# EAGLE schematic ard_card (EAGLE 5.06)
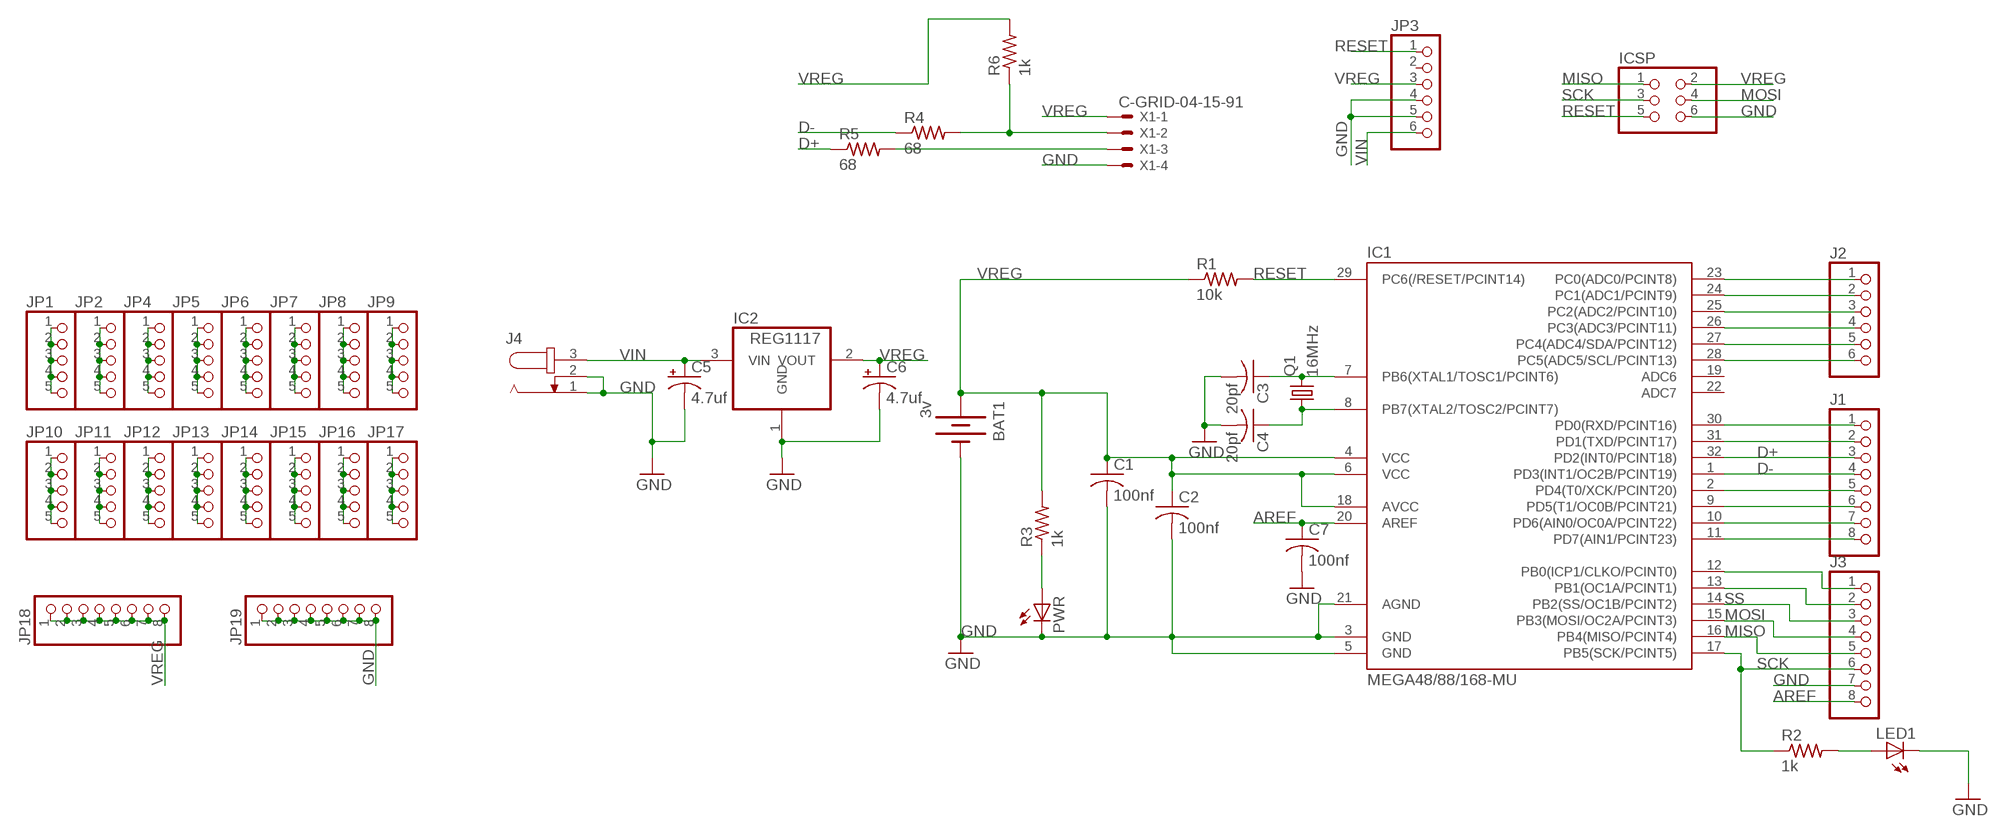
[diagram p0: schematic, sheet 1]

## Parts
BAT1  3v  BATTERY12MM  [BATTCON_12MM]
C1  100nf  C-USC0603  [C0603]
C2  100nf  C-USC0603  [C0603]
C3  20pf  C-USC0603  [C0603]
C4  20pf  C-USC0603  [C0603]
C5  4.7uf  CPOL-USA/3216-18R  [A/3216-18R]
C6  4.7uf  CPOL-USA/3216-18R  [A/3216-18R]
C7  100nf  C-USC0603  [C0603]
IC1  MEGA48/88/168-MU  [MLF32]
IC2  REG1117  [SOT223]
ICSP  PINHD-2X3  [2X03]
J1  PINHD-1X8  [1X08]
J2  PINHD-1X6  [1X06]
J3  PINHD-1X8  [1X08]
J4  JACK-PLUG1  [SPC4078]
JP1  PINHD-1X5  [1X05]
JP2  PINHD-1X5  [1X05]
JP3  PINHD-1X6  [1X06]
JP4  PINHD-1X5  [1X05]
JP5  PINHD-1X5  [1X05]
JP6  PINHD-1X5  [1X05]
JP7  PINHD-1X5  [1X05]
JP8  PINHD-1X5  [1X05]
JP9  PINHD-1X5  [1X05]
JP10  PINHD-1X5  [1X05]
JP11  PINHD-1X5  [1X05]
JP12  PINHD-1X5  [1X05]
JP13  PINHD-1X5  [1X05]
JP14  PINHD-1X5  [1X05]
JP15  PINHD-1X5  [1X05]
JP16  PINHD-1X5  [1X05]
JP17  PINHD-1X5  [1X05]
JP18  PINHD-1X8  [1X08]
JP19  PINHD-1X8  [1X08]
LED1  LEDCHIP-LED0603  [CHIP-LED0603]
PWR  LEDCHIP-LED0603  [CHIP-LED0603]
Q1  16MHz  CRYSTAL5X3  [CRYSTAL-SMD-5X3]
R1  10k  R-US_R0603  [R0603]
R2  1k  R-US_R0603  [R0603]
R3  1k  R-US_R0603  [R0603]
R4  68  R-US_R0603  [R0603]
R5  68  R-US_R0603  [R0603]
R6  1k  R-US_R0603  [R0603]
X1  C-GRID-04-15-91  [15-91-04]

## Nets
AREF: C7.1 IC1.20(AREF) J3.8
D+: IC1.32(PD2(INT0/PCINT18)) J1.3 R5.1
D-: IC1.1(PD3(INT1/OC2B/PCINT19)) J1.4 R4.1
GND: BAT1.GND(-) C1.2 C2.2 C3.2 C4.2 C5.- C6.- C7.2 IC1.3(GND) IC1.5(GND) IC1.21(AGND) IC2.1(GND) ICSP.6 J3.7 J4.1 J4.2 JP3.4 JP3.5 JP19.1 JP19.2 JP19.3 JP19.4 JP19.5 JP19.6 JP19.7 JP19.8 LED1.C PWR.C X1.4
MISO: IC1.16(PB4(MISO/PCINT4)) ICSP.1 J3.5
MOSI: IC1.15(PB3(MOSI/OC2A/PCINT3)) ICSP.4 J3.4
N$1: C3.1 IC1.7(PB6(XTAL1/TOSC1/PCINT6)) Q1.3
N$2: C4.1 IC1.8(PB7(XTAL2/TOSC2/PCINT7)) Q1.1
N$3: PWR.A R3.1
N$4: R5.2 X1.3
N$6: LED1.A R2.2
N$7: IC1.23(PC0(ADC0/PCINT8)) J2.1
N$8: IC1.24(PC1(ADC1/PCINT9)) J2.2
N$9: IC1.25(PC2(ADC2/PCINT10)) J2.3
N$10: IC1.26(PC3(ADC3/PCINT11)) J2.4
N$11: IC1.27(PC4(ADC4/SDA/PCINT12)) J2.5
N$12: IC1.28(PC5(ADC5/SCL/PCINT13)) J2.6
N$13: IC1.30(PD0(RXD/PCINT16)) J1.1
N$14: IC1.31(PD1(TXD/PCINT17)) J1.2
N$15: R4.2 R6.1 X1.2
N$16: JP1.1 JP1.2 JP1.3 JP1.4 JP1.5
N$17: IC1.2(PD4(T0/XCK/PCINT20)) J1.5
N$18: IC1.9(PD5(T1/OC0B/PCINT21)) J1.6
N$19: IC1.10(PD6(AIN0/OC0A/PCINT22)) J1.7
N$20: IC1.11(PD7(AIN1/PCINT23)) J1.8
N$21: IC1.12(PB0(ICP1/CLKO/PCINT0)) J3.1
N$22: IC1.13(PB1(OC1A/PCINT1)) J3.2
N$23: JP2.1 JP2.2 JP2.3 JP2.4 JP2.5
N$24: JP4.1 JP4.2 JP4.3 JP4.4 JP4.5
N$25: JP5.1 JP5.2 JP5.3 JP5.4 JP5.5
N$26: JP6.1 JP6.2 JP6.3 JP6.4 JP6.5
N$27: JP7.1 JP7.2 JP7.3 JP7.4 JP7.5
N$28: JP8.1 JP8.2 JP8.3 JP8.4 JP8.5
N$29: JP9.1 JP9.2 JP9.3 JP9.4 JP9.5
N$30: JP10.1 JP10.2 JP10.3 JP10.4 JP10.5
N$31: JP11.1 JP11.2 JP11.3 JP11.4 JP11.5
N$32: JP12.1 JP12.2 JP12.3 JP12.4 JP12.5
N$33: JP13.1 JP13.2 JP13.3 JP13.4 JP13.5
N$34: JP14.1 JP14.2 JP14.3 JP14.4 JP14.5
N$35: JP15.1 JP15.2 JP15.3 JP15.4 JP15.5
N$36: JP16.1 JP16.2 JP16.3 JP16.4 JP16.5
N$37: JP17.1 JP17.2 JP17.3 JP17.4 JP17.5
RESET: IC1.29(PC6(/RESET/PCINT14)) ICSP.5 JP3.1 R1.2
SCK: IC1.17(PB5(SCK/PCINT5)) ICSP.3 J3.6 R2.1
SS: IC1.14(PB2(SS/OC1B/PCINT2)) J3.3
VIN: C5.+ IC2.3(VIN) J4.3 JP3.6
VREG: BAT1.PWR@1(+) C1.1 C2.1 C6.+ IC1.4(VCC) IC1.6(VCC) IC1.18(AVCC) IC2.2(VOUT) ICSP.2 JP3.3 JP18.1 JP18.2 JP18.3 JP18.4 JP18.5 JP18.6 JP18.7 JP18.8 R1.1 R3.2 R6.2 X1.1
Unconnected: IC1.19(ADC6) IC1.22(ADC7) JP3.2

## Library data of the parts
BAT1 = SparkFun.1:BATTERY: Battery Holders Various common sizes : AA, AAA, 20mm coin cell and 12mm coin cell.
C1-C4 C7 = rcl:C-US: CAPACITOR, American symbol
C5 C6 = rcl:CPOL-US: POLARIZED CAPACITOR, American symbol
IC1 = avr-6:MEGA48/88/168
IC2 = burr-brown:REG1117: 800mA and 1A Low Dropout (LDO) Positive Regulator 1.8V, 2.5V, 2.85V, 3.3V, 5V, and Adj
ICSP = pinhead:PINHD-2X3: PIN HEADER
J1 J3 JP18 JP19 = pinhead:PINHD-1X8: PIN HEADER
J2 JP3 = pinhead:PINHD-1X6: PIN HEADER
J4 = con-jack:JACK-PLUG: DC POWER JACK Power Jack, DC, Right Angle, Through Hole, Rated 5A at 16VDC, PC Terminals Distributor: Farnell (www.Farnell.de) Drawing: 84N1161.pdf / 84N1162.pdf Manufacturer: SPC Technology (www.spctechnology.com) Type: SPC4077 / SPC 4078
JP1 JP2 JP4-JP17 = pinhead:PINHD-1X5: PIN HEADER
LED1 PWR = led:LED: LED OSRAM: - CHIPLED LG R971, LG N971, LY N971, LG Q971, LY Q971, LO R971, LY R971 LH N974, LH R974 LS Q976, LO Q976, LY Q976 LO Q996 - Hyper CHIPLED LW Q18S LB Q993, LB Q99A, LB R99A - SideLED LS A670, LO A670, LY A670, LG A670, LP A670 LB A673, LV A673, LT A673, LW A673 LH A674 LY A675 LS A676, LA A676, LO A676, LY A676, LW A676 LS A679, LY A679, LG A679 - Hyper Micro SIDELED® LS Y876, LA Y876, LO Y876, LY Y876 LT Y87S - SmartLED LW L88C, LW L88S LB L89C, LB L89S, LG L890 LS L89K, LO L89K, LY L89K LS L896, LA L896, LO L896, LY L896 - TOPLED LS T670, LO T670, LY T670, LG T670, LP T670 LSG T670, LSP T670, LSY T670, LOP T670, LYG T670 LG T671, LOG T671, LSG T671 LB T673, LV T673, LT T673, LW T673 LH T674 LS T676, LA T676, LO T676, LY T676, LB T676, LH T676, LSB T676, LW T676 LB T67C, LV T67C, LT T67C, LS T67K, LO T67K, LY T67K, LW E67C LS E67B, LA E67B, LO E67B, LY E67B, LB E67C, LV E67C, LT E67C LW T67C LS T679, LY T679, LG T679 LS T770, LO T770, LY T770, LG T770, LP T770 LB T773, LV T773, LT T773, LW T773 LH T774 LS E675, LA E675, LY E675, LS T675 LS T776, LA T776, LO T776, LY T776, LB T776 LHGB T686 LT T68C, LB T68C - Hyper Mini TOPLED® LB M676 - Mini TOPLED Santana® LG M470 LS M47K, LO M47K, LY M47K Source: http://www.osram.convergy.de LUXEON: - LUMILED® LXK2-PW12-R00, LXK2-PW12-S00, LXK2-PW14-U00, LXK2-PW14-V00 LXK2-PM12-R00, LXK2-PM12-S00, LXK2-PM14-U00 LXK2-PE12-Q00, LXK2-PE12-R00, LXK2-PE12-S00, LXK2-PE14-T00, LXK2-PE14-U00 LXK2-PB12-K00, LXK2-PB12-L00, LXK2-PB12-M00, LXK2-PB14-N00, LXK2-PB14-P00, LXK2-PB14-Q00 LXK2-PR12-L00, LXK2-PR12-M00, LXK2-PR14-Q00, LXK2-PR14-R00 LXK2-PD12-Q00, LXK2-PD12-R00, LXK2-PD12-S00 LXK2-PH12-R00, LXK2-PH12-S00 LXK2-PL12-P00, LXK2-PL12-Q00, LXK2-PL12-R00 Source: www.luxeon.com KINGBRIGHT: KA-3528ASYC Source: www.kingbright.com
Q1 = SparkFun.1:CRYSTAL: Crystals Various standard crystals. Proven footprints. Spark Fun Electronics SKU : COM-00534
R1-R6 = rcl:R-US_: RESISTOR, American symbol
X1 = con-molex:C-GRID-04: CONNECTOR wire to board 2.54 mm (0.100") pitch header